# Altium project PIFWRoBot.PrjPcb
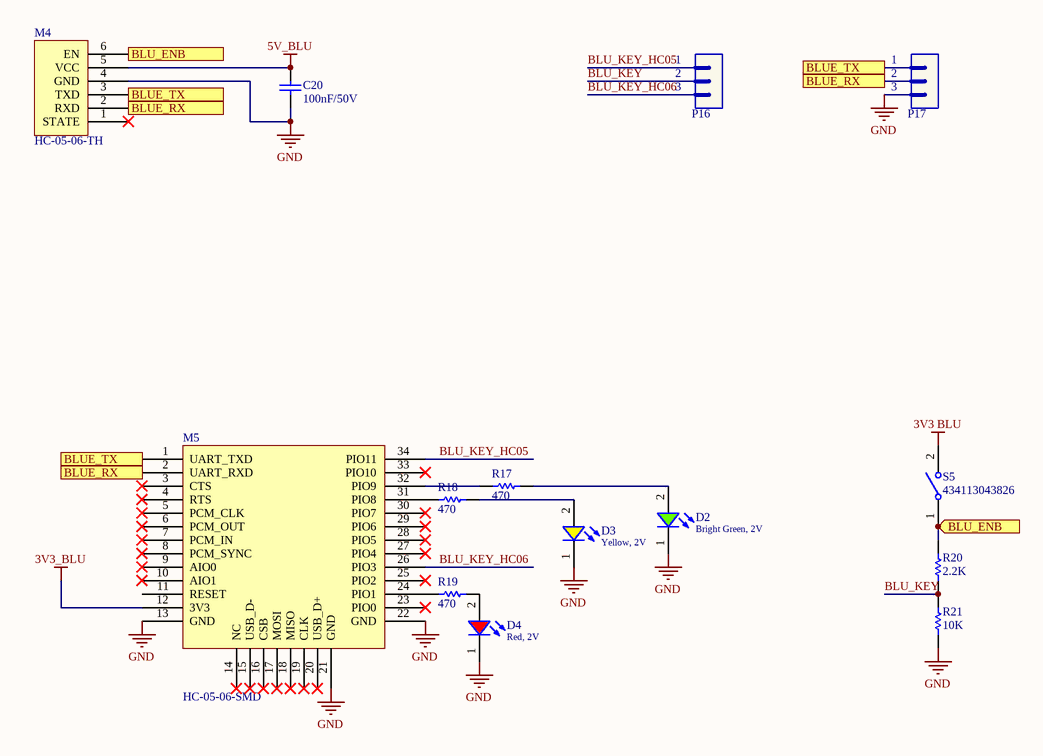
[diagram p0: Bluetooth.SchDoc]
4 sheets, 76 parts. Net scope: flat (ports and power ports of the same name join across sheets).
Board file: PIFWRoBot.PcbDoc
Sheets:
  Bluetooth.SchDoc
  Decawave.SchDoc
  RF.SchDoc
  Wifi.SchDoc

## Sheet Bluetooth.SchDoc
size A

### Parts
(Parts that share a designator on the sheet are numbered #1, #2 ... from top to bottom, then left to right.)
C20  value 100nF/50V  [CAP-SM-0805]  (hidden comment: Cap-100nF-50V-0805)
D2  Bright Green, 2V  [WL-SMCW_0805]
D3  Yellow, 2V  [WL-SMCW_0805]
D4  Red, 2V  [WL-SMCW_0805]
M4  HC-05-06-TH  [HC-05-06-TH]
M5  HC-05-06-SMD  [HC-05-06-SMD]
P16  Header 3  [JP3]  (value not drawn)
P17  Header 3  [JP3]  (value not drawn)
R17  value 470  [RES-SM-0805]  (hidden comment: Res-470-0805)
R18  value 470  [RES-SM-0805]  (hidden comment: Res-470-0805)
R19  value 470  [RES-SM-0805]  (hidden comment: Res-470-0805)
R20#1  value 2.2K  [RES-SM-0805]  (hidden comment: Res-2.2K-0805)
R21#1  value 10K  [RES-SM-0805]  (hidden comment: Res-10k-0805)
S5  434113043826  [434113043826]

### Ports
BLU_ENB (in), BLU_ENB (out), BLUE_RX (in), BLUE_RX (out), BLUE_TX (in)

### Nets
3V3 BLU: S5.2
3V3_BLU: M5.12(3V3)
5V_BLU: C20.2 M4.5(VCC)
GND: C20.1 D2.1(K) D3.1(K) D4.1(K) M4.4(GND) M5.13(GND) M5.21(GND) M5.22(GND) P17.3 R21#1.1
BLU_KEY: P16.2 R20#1.1 R21#1.2
BLU_KEY_HC05: M5.34(PIO11) P16.1
BLU_KEY_HC06: M5.26(PIO3) P16.3
NetD2_2: D2.2(A) R17.2
NetD3_2: D3.2(A) R18.2
NetD4_2: D4.2(A) R19.2
NetM4_2: M4.2(RXD) M5.2(UART_RXD) P17.2 ; port BLUE_RX
NetM4_3: M4.3(TXD) M5.1(UART_TXD) P17.1 ; port BLUE_TX
NetM4_6: M4.6(EN) R20#1.2 S5.1 ; port BLU_ENB
NetM5_24: M5.24(PIO1) R19.1
NetM5_31: M5.31(PIO8) R18.1
NetM5_32: M5.32(PIO9) R17.1

Not connected (* = marked no-connect by the designer): M4 1(STATE)*; M5 3(CTS)* 4(RTS)* 5(PCM_CLK)* 6(PCM_OUT)* 7(PCM_IN)* 8(PCM_SYNC)* 9(AIO0)* 10(AIO1)* 11(RESET) 14(NC)* 15(USB_D-)* 16(CSB)* 17(MOSI)* 18(MISO)* 19(CLK)* 20(USB_D+)* 23(PIO0)* 25(PIO2)* 27(PIO4)* 28(PIO5)* 29(PIO6)* 30(PIO7)* 33(PIO10)*

### Library data of the parts
C20 = Cap-100nF-50V-0805: CAP CER 0.1UF 50V Y5V 0805; Manufacturer: Samsung Electro-Mechanics; Manufacturer Part Number: CL21F104ZBCNNNC; Local Supplier: thegioiic; Local Supplier Link: https://thegioiic.com/products/tu-100nf-0-1uf-50v-0805; Supplier 1: Digikey; Supplier 1 Part Number: 1276-1007-1-ND; Supplier 1 Link: https://www.digikey.com/product-detail/en/samsung-electro-mechanics/CL21F104ZBCNNNC/1276-1007-1-ND/3889093
D2 = 150080VS75000: WL-SMCW SMT Mono-color Chip LED Waterclear, size 0805, Bright Green, 2V, 140deg; Chip Technology: AlInGaP; Dominant Wavelength typ.: 570nm; Luminous Intensity typ.: 40mcd; Peak Wavelength typ.: 572nm; Viewing Angle: 140deg; ComponentLink1Description: Manufacturer; ComponentLink1URL: http://www.we-online.de; ComponentLink2URL: https://www.we-online.com/catalog/datasheet/150080VS75000.pdf; ComponentLink2Description: Datasheet; Forward Voltage typ.: 2V; Emitting Color: Bright Green; Mounting Technology: SMT; Operating Temperature: -40 to +85degC; Published Date: December 2019; Part Number: 150080VS75000; Packaging: Tape and Reel; Size: 0805; Publisher: Wurth Elektronik
D3 = 150080YS75000: WL-SMCW SMT Mono-color Chip LED Waterclear, size 0805, Yellow, 2V, 140deg; Chip Technology: AlInGaP; Dominant Wavelength typ.: 590nm; Luminous Intensity typ.: 120mcd; Peak Wavelength typ.: 595nm; Viewing Angle: 140deg; ComponentLink1Description: Manufacturer; ComponentLink1URL: http://www.we-online.de; ComponentLink2URL: https://www.we-online.com/catalog/datasheet/150080YS75000.pdf; ComponentLink2Description: Datasheet; Forward Voltage typ.: 2V; Emitting Color: Yellow; Mounting Technology: SMT; Operating Temperature: -40 to +85degC; Published Date: December 2019; Part Number: 150080YS75000; Packaging: Tape and Reel; Size: 0805; Publisher: Wurth Elektronik
D4 = 150080RS75000: WL-SMCW SMT Mono-color Chip LED Waterclear, size 0805, Red, 2V, 140deg; Chip Technology: AlInGaP; Dominant Wavelength typ.: 625nm; Luminous Intensity typ.: 150mcd; Peak Wavelength typ.: 630nm; Viewing Angle: 140deg; ComponentLink1Description: Manufacturer; ComponentLink1URL: http://www.we-online.de; ComponentLink2URL: https://www.we-online.com/catalog/datasheet/150080RS75000.pdf; ComponentLink2Description: Datasheet; Forward Voltage typ.: 2V; Emitting Color: Red; Mounting Technology: SMT; Operating Temperature: -40 to +85degC; Published Date: December 2019; Part Number: 150080RS75000; Packaging: Tape and Reel; Size: 0805; Publisher: Wurth Elektronik
P16 P17 = Header 3: Header, 3-Pin; LatestRevisionDate: 17-Jul-2002; LatestRevisionNote: Re-released for DXP Platform.; Publisher: Altium Limited
R17-R19 = Res-470-0805: RES 470 OHM JUMPER 0805; Manufacturer: YAG6006CT-ND; Manufacturer Part Number: PE0805FRF7W0R047L; Local Supplier: thegioiic; Local Supplier Link: https://www.thegioiic.com/products/dien-tro-470-kohm-0805-5; Supplier 1: Digikey; Supplier 1 Link: https://www.digikey.com/product-detail/en/yageo/PE0805FRF7W0R047L/YAG6006CT-ND/9696460; Supplier 1 Part Number: YAG6006CT-ND
R20#1 = Res-2.2K-0805: RES SMD 2.2K OHM 1% 1/8W 0805; Manufacturer: TE Connectivity Passive Product; Manufacturer Part Number: CRG0805F2K2; Local Supplier: thegioiic; Local Supplier Link: https://thegioiic.com/products/dien-tro-2-2k-ohm-0805-5; Supplier 1: Digikey; Supplier 1 Link: https://www.digikey.com/product-detail/en/te-connectivity-passive-product/CRG0805F2K2/A106060CT-ND/3477706; Supplier 1 Part Number: A106060CT-ND
R21#1 = Res-10k-0805: RES 10K OHM 1% 1/4W 0805; Manufacturer: Stackpole Electronics Inc; Manufacturer Part Number: RNCP0805FTD10K0; Local Supplier: thegioiic; Local Supplier Link: https://thegioiic.com/products/dien-tro-10k-ohm-0805-5; Supplier 1: Digikey; Supplier 1 Link: https://www.digikey.com/product-detail/en/stackpole-electronics-inc/RNCP0805FTD10K0/RNCP0805FTD10K0CT-ND/2240601; Supplier 1 Part Number: RNCP0805FTD10K0CT-ND
S5 = 434113043826: WS-TASV J-Bend SMT Tact Switch 6x3.5mm, height 4.3mm, 260gf; Rated Voltage: 12VDC; Rated Current: 50mA; Washable: No; ComponentLink1Description: Manufacturer; ComponentLink1URL: http://www.we-online.de; ComponentLink2Description: Datasheet; ComponentLink2URL: https://katalog.we-online.com/em/datasheet/434113043826.pdf; Operating Temperature: -40 to +85degC; Part Number: 434113043826; Published Date: September 2019; Contact Material: Stainless Steel; Height: 4.3mm; Mounting Technology: SMT; Contact Plating: Silver; Operation Force: 260gf; Packaging: Tape and Reel; Terminal Material: Copper Alloy; Publisher: Wurth Elektronik; Terminal Plating: Silver
M4 = HC-05-06-TH: Local Supplier Link: https://hshop.vn/products/mach-thu-phat-bluetooth-hc-05-do-ra-chon-master; Local Supplier Part Number: HS000882; Manufacturer: *; Manufacturer Part Number: *; Local Supplier: HShop
M5 = HC-05-06-SMD: Local Supplier Link: https://hshop.vn/products/mach-thu-phat-bluetooth-hc-05-chua-ra-chon-master; Local Supplier Part Number: HS000881; Manufacturer: *; Manufacturer Part Number: *; Local Supplier: HShop

## Sheet Decawave.SchDoc
size A
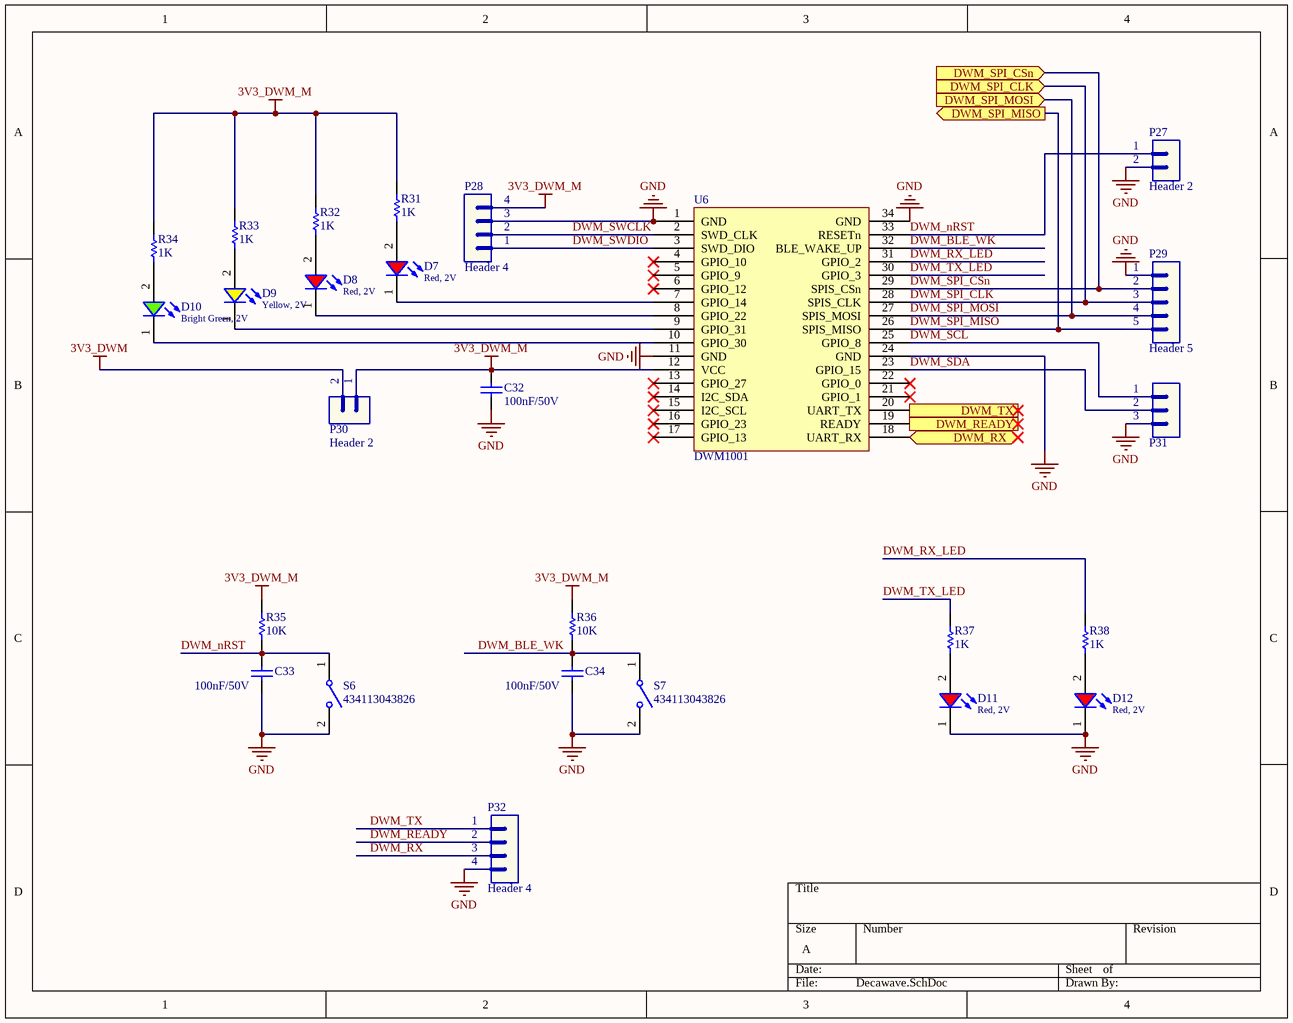
[diagram p1: Decawave.SchDoc]

### Parts
C32  value 100nF/50V  [CAP-SM-0805]  (hidden comment: Cap-100nF-50V-0805)
C33  value 100nF/50V  [CAP-SM-0805]  (hidden comment: Cap-100nF-50V-0805)
C34  value 100nF/50V  [CAP-SM-0805]  (hidden comment: Cap-100nF-50V-0805)
D7  Red, 2V  [WL-SMCW_0805]
D8  Red, 2V  [WL-SMCW_0805]
D9  Yellow, 2V  [WL-SMCW_0805]
D10  Bright Green, 2V  [WL-SMCW_0805]
D11  Red, 2V  [WL-SMCW_0805]
D12  Red, 2V  [WL-SMCW_0805]
P27  Header 2  [JP2]
P28  Header 4  [JP4]
P29  Header 5  [JP5]
P30  Header 2  [JP2]
P31  Header 3  [JP3]  (value not drawn)
P32  Header 4  [JP4]
R31  value 1K  [RES-SM-0805]  (hidden comment: Res-1K-0805)
R32  value 1K  [RES-SM-0805]  (hidden comment: Res-1K-0805)
R33  value 1K  [RES-SM-0805]  (hidden comment: Res-1K-0805)
R34  value 1K  [RES-SM-0805]  (hidden comment: Res-1K-0805)
R35  value 10K  [RES-SM-0805]  (hidden comment: Res-10k-0805)
R36  value 10K  [RES-SM-0805]  (hidden comment: Res-10k-0805)
R37  value 1K  [RES-SM-0805]  (hidden comment: Res-1K-0805)
R38  value 1K  [RES-SM-0805]  (hidden comment: Res-1K-0805)
S6  434113043826  [434113043826]
S7  434113043826  [434113043826]
U6  DWM1001  [DWM1001]

### Ports
DWM_READY, DWM_RX (bidir), DWM_SPI_CLK (in), DWM_SPI_CSn (in), DWM_SPI_MISO (out), DWM_SPI_MOSI (in), DWM_TX

### Nets
3V3_DWM: P30.2
3V3_DWM_M: C32.2 P28.4 P30.1 R31.2 R32.2 R33.2 R34.2 R35.2 R36.2 U6.12(VCC)
GND: C32.1 C33.2 C34.2 D11.1(K) D12.1(K) P27.2 P28.3 P29.1 P31.3 P32.4 S6.2 S7.2 U6.1(GND) U6.11(GND) U6.24(GND) U6.34(GND)
DWM_BLE_WK: C34.1 R36.1 S7.1 U6.32(BLE_WAKE_UP)
DWM_nRST: C33.1 P27.1 R35.1 S6.1 U6.33(RESETn)
DWM_READY: P32.2
DWM_RX: P32.3
DWM_RX_LED: R38.2 U6.31(GPIO_2)
DWM_SCL: P31.1 U6.25(GPIO_8)
DWM_SDA: P31.2 U6.23(GPIO_15)
DWM_SPI_CLK: P29.3 U6.28(SPIS_CLK) ; port DWM_SPI_CLK
DWM_SPI_CSn: P29.2 U6.29(SPIS_CSn) ; port DWM_SPI_CSn
DWM_SPI_MISO: P29.5 U6.26(SPIS_MISO) ; port DWM_SPI_MISO
DWM_SPI_MOSI: P29.4 U6.27(SPIS_MOSI) ; port DWM_SPI_MOSI
DWM_SWCLK: P28.2 U6.2(SWD_CLK)
DWM_SWDIO: P28.1 U6.3(SWD_DIO)
DWM_TX: P32.1
DWM_TX_LED: R37.2 U6.30(GPIO_3)
NetD7_1: D7.1(K) U6.7(GPIO_14)
NetD7_2: D7.2(A) R31.1
NetD8_1: D8.1(K) U6.8(GPIO_22)
NetD8_2: D8.2(A) R32.1
NetD9_1: D9.1(K) U6.9(GPIO_31)
NetD9_2: D9.2(A) R33.1
NetD10_1: D10.1(K) U6.10(GPIO_30)
NetD10_2: D10.2(A) R34.1
NetD11_2: D11.2(A) R37.1
NetD12_2: D12.2(A) R38.1
NetU6_18: U6.18(UART_RX) ; port DWM_RX
NetU6_19: U6.19(READY) ; port DWM_READY
NetU6_20: U6.20(UART_TX) ; port DWM_TX

Not connected (* = marked no-connect by the designer): U6 4(GPIO_10)* 5(GPIO_9)* 6(GPIO_12)* 13(GPIO_27)* 14(I2C_SDA)* 15(I2C_SCL)* 16(GPIO_23)* 17(GPIO_13)* 21(GPIO_1)* 22(GPIO_0)*

### Library data of the parts
C32-C34 = Cap-100nF-50V-0805: as C20 on sheet Bluetooth; Local Supplier: thegioiic; Local Supplier Link: https://thegioiic.com/products/tu-100nf-0-1uf-50v-0805; Supplier 1: Digikey; Supplier 1 Part Number: 1276-1007-1-ND; Supplier 1 Link: https://www.digikey.com/product-detail/en/samsung-electro-mechanics/CL21F104ZBCNNNC/1276-1007-1-ND/3889093
D7 D8 D11 D12 = 150080RS75000: as D4 on sheet Bluetooth; Viewing Angle: 140deg; ComponentLink1Description: Manufacturer; ComponentLink1URL: http://www.we-online.de; ComponentLink2URL: https://www.we-online.com/catalog/datasheet/150080RS75000.pdf; ComponentLink2Description: Datasheet; Forward Voltage typ.: 2V; Emitting Color: Red; Mounting Technology: SMT; Operating Temperature: -40 to +85degC; Published Date: December 2019; Part Number: 150080RS75000; Packaging: Tape and Reel; Size: 0805; Publisher: Wurth Elektronik
D9 = 150080YS75000: as D3 on sheet Bluetooth; Viewing Angle: 140deg; ComponentLink1Description: Manufacturer; ComponentLink1URL: http://www.we-online.de; ComponentLink2URL: https://www.we-online.com/catalog/datasheet/150080YS75000.pdf; ComponentLink2Description: Datasheet; Forward Voltage typ.: 2V; Emitting Color: Yellow; Mounting Technology: SMT; Operating Temperature: -40 to +85degC; Published Date: December 2019; Part Number: 150080YS75000; Packaging: Tape and Reel; Size: 0805; Publisher: Wurth Elektronik
D10 = 150080VS75000: as D2 on sheet Bluetooth; Viewing Angle: 140deg; ComponentLink1Description: Manufacturer; ComponentLink1URL: http://www.we-online.de; ComponentLink2URL: https://www.we-online.com/catalog/datasheet/150080VS75000.pdf; ComponentLink2Description: Datasheet; Forward Voltage typ.: 2V; Emitting Color: Bright Green; Mounting Technology: SMT; Operating Temperature: -40 to +85degC; Published Date: December 2019; Part Number: 150080VS75000; Packaging: Tape and Reel; Size: 0805; Publisher: Wurth Elektronik
P27 P30 = Header 2: Header, 2-Pin; LatestRevisionDate: 17-Jul-2002; LatestRevisionNote: Re-released for DXP Platform.; Publisher: Altium Limited
P28 P32 = Header 4: Header, 4-Pin; LatestRevisionDate: 17-Jul-2002; LatestRevisionNote: Re-released for DXP Platform.; Publisher: Altium Limited
P29 = Header 5: Header, 5-Pin; LatestRevisionDate: 17-Jul-2002; LatestRevisionNote: Re-released for DXP Platform.; Publisher: Altium Limited
P31 = Header 3: Header, 3-Pin; LatestRevisionDate: 17-Jul-2002; LatestRevisionNote: Re-released for DXP Platform.; Publisher: Altium Limited
R31-R34 R37 R38 = Res-1K-0805: RES 1K OHM 1% 1/4W 0805; Manufacturer: Stackpole Electronics Inc; Manufacturer Part Number: RNCP0805FTD1K00; Local Supplier: thegioiic; Local Supplier Link: https://thegioiic.com/products/dien-tro-1k-ohm-0805-5; Supplier 1: Digikey; Supplier 1 Link: https://www.digikey.com/product-detail/en/stackpole-electronics-inc/RNCP0805FTD1K00/RNCP0805FTD1K00CT-ND/2240568; Supplier 1 Part Number: RNCP0805FTD1K00CT-ND
R35 R36 = Res-10k-0805: as R21#1 on sheet Bluetooth; Local Supplier: thegioiic; Local Supplier Link: https://thegioiic.com/products/dien-tro-10k-ohm-0805-5; Supplier 1: Digikey; Supplier 1 Link: https://www.digikey.com/product-detail/en/stackpole-electronics-inc/RNCP0805FTD10K0/RNCP0805FTD10K0CT-ND/2240601; Supplier 1 Part Number: RNCP0805FTD10K0CT-ND
S6 S7 = 434113043826: as S5 on sheet Bluetooth; ComponentLink1Description: Manufacturer; ComponentLink1URL: http://www.we-online.de; ComponentLink2Description: Datasheet; ComponentLink2URL: https://katalog.we-online.com/em/datasheet/434113043826.pdf; Operating Temperature: -40 to +85degC; Part Number: 434113043826; Published Date: September 2019; Contact Material: Stainless Steel; Height: 4.3mm; Mounting Technology: SMT; Contact Plating: Silver; Operation Force: 260gf; Packaging: Tape and Reel; Terminal Material: Copper Alloy; Publisher: Wurth Elektronik; Terminal Plating: Silver

## Sheet RF.SchDoc
size A
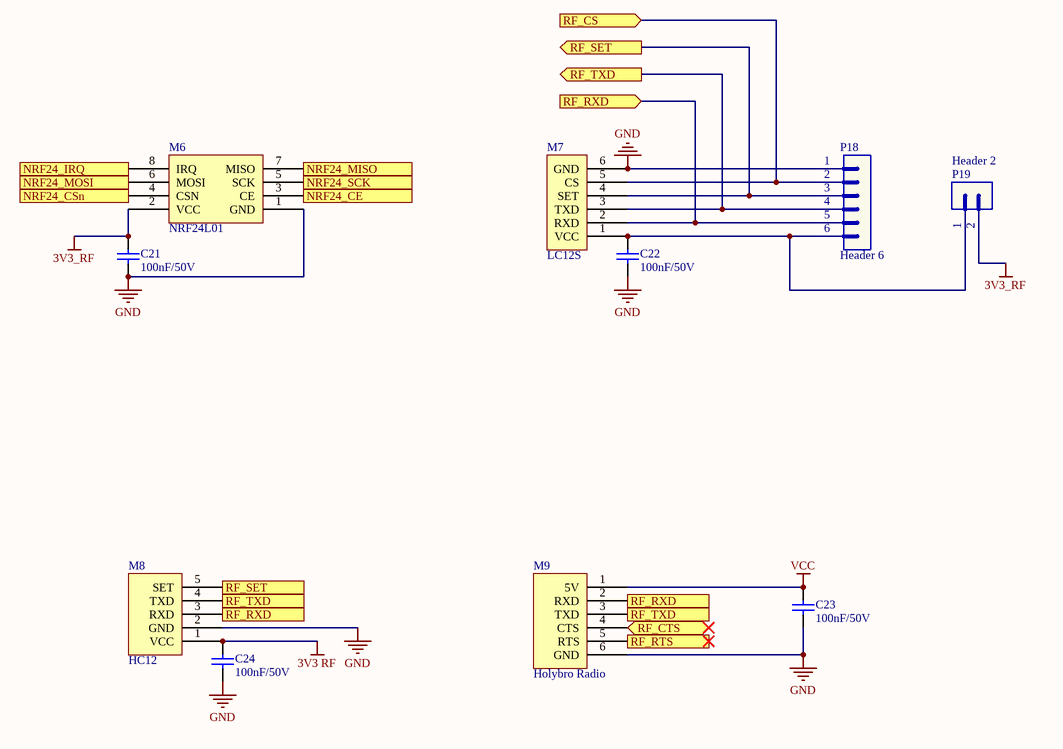
[diagram p2: RF.SchDoc]

### Parts
C21  value 100nF/50V  [CAP-SM-0805]  (hidden comment: Cap-100nF-50V-0805)
C22  value 100nF/50V  [CAP-SM-0805]  (hidden comment: Cap-100nF-50V-0805)
C23  value 100nF/50V  [CAP-SM-0805]  (hidden comment: Cap-100nF-50V-0805)
C24  value 100nF/50V  [CAP-SM-0805]  (hidden comment: Cap-100nF-50V-0805)
M6  NRF24L01  [NRF24L01]
M7  LC12S  [LC12S]
M8  HC12  [HC12]
M9  Holybro Radio  [HOLYBRO RADIO]
P18  Header 6  [JP6]
P19  Header 2  [JP2]

### Ports
NRF24_CE (in), NRF24_CSn (in), NRF24_IRQ (out), NRF24_MISO (out), NRF24_MOSI (in), NRF24_SCK (in), RF_CS (in), RF_CTS (bidir), RF_RTS, RF_RXD (in), RF_RXD (out), RF_SET (out), RF_TXD (in), RF_TXD (out)

### Nets
3V3 RF: C24.2 M8.1(VCC)
3V3_RF: C21.2 M6.2(VCC) P19.2
GND: C21.1 C22.1 C23.1 C24.1 M6.1(GND) M7.6(GND) M8.2(GND) M9.6(GND) P18.1
VCC: C23.2 M9.1(5V)
NetC22_2: C22.2 M7.1(VCC) P18.6 P19.1
NetM6_3: M6.3(CE) ; port NRF24_CE
NetM6_4: M6.4(CSN) ; port NRF24_CSn
NetM6_5: M6.5(SCK) ; port NRF24_SCK
NetM6_6: M6.6(MOSI) ; port NRF24_MOSI
NetM6_7: M6.7(MISO) ; port NRF24_MISO
NetM6_8: M6.8(IRQ) ; port NRF24_IRQ
NetM7_2: M7.2(RXD) M8.3(RXD) M9.2(RXD) P18.5 ; port RF_RXD
NetM7_3: M7.3(TXD) M8.4(TXD) M9.3(TXD) P18.4 ; port RF_TXD
NetM7_4: M7.4(SET) M8.5(SET) P18.3 ; port RF_SET
NetM7_5: M7.5(CS) P18.2 ; port RF_CS
NetM9_4: M9.4(CTS) ; port RF_CTS
NetM9_5: M9.5(RTS) ; port RF_RTS

### Library data of the parts
C21-C24 = Cap-100nF-50V-0805: as C20 on sheet Bluetooth; Local Supplier: thegioiic; Local Supplier Link: https://thegioiic.com/products/tu-100nf-0-1uf-50v-0805; Supplier 1: Digikey; Supplier 1 Part Number: 1276-1007-1-ND; Supplier 1 Link: https://www.digikey.com/product-detail/en/samsung-electro-mechanics/CL21F104ZBCNNNC/1276-1007-1-ND/3889093
P18 = Header 6: Header, 6-Pin; LatestRevisionDate: 17-Jul-2002; LatestRevisionNote: Re-released for DXP Platform.; Publisher: Altium Limited
P19 = Header 2: Header, 2-Pin; LatestRevisionDate: 17-Jul-2002; LatestRevisionNote: Re-released for DXP Platform.; Publisher: Altium Limited
M6 = NRF24L01: Local Supplier Link: https://hshop.vn/products/mach-thu-phat-nrf24l01-pa-2-4ghzcu-khech-dai-cung-suat-thu-phat; Local Supplier Part Number: HS000888; Manufacturer: *; Manufacturer Part Number: *; Local Supplier: HShop
M7 = LC12S: Local Supplier: HShop; Local Supplier Link: https://hshop.vn/products/mach-thu-phat-rf-uart-lc12s-2-4ghz; Local Supplier Part Number: HS000895; Manufacturer: *; Manufacturer Part Number: *
M8 = HC12: Local Supplier Link: https://hshop.vn/products/mach-thu-phat-rf-uart-si4463-433mhzkhoang-coch-1km; Local Supplier Part Number: HS000897; Manufacturer: *; Manufactuer Part Number: *; Local Supplier: HShop
M9 = HOLYBRO RADIO: Supploer Part Number: *; Supplier: *; Supploer Link: https://www.lazada.vn/products/ld-holybro-433mhz-915-mhz-500-mw-thu-phat-vo-tuyen-xa-bo-v3-cho-pixhawk-4-dieu-khien-chuyen-bay-i430804435-s768474304.html?spm=a2o4n.searchlist.list.4.25396b19yIS9XO&search=1; Manufacturer Part Number: *; Manufacturer: *

## Sheet Wifi.SchDoc
size A
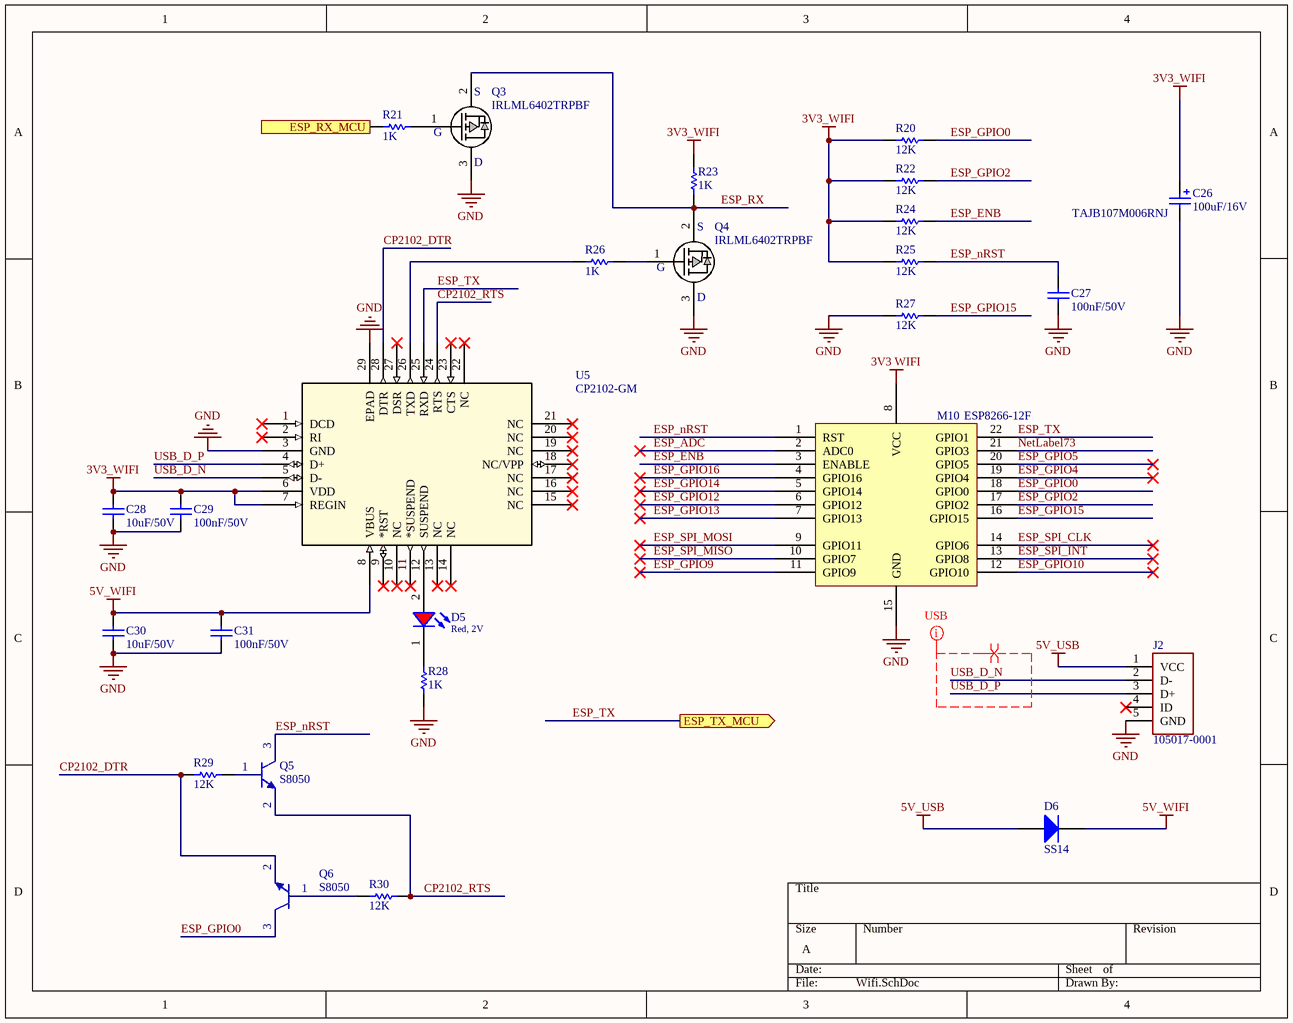
[diagram p3: Wifi.SchDoc]

### Parts
(Parts that share a designator on the sheet are numbered #1, #2 ... from top to bottom, then left to right.)
C26  value 100uF/16V  [CAP-SM-AL-SIZE-D-D6L6]  (hidden comment: Cap-Al-100uF-16V-D6L5)
C27  value 100nF/50V  [CAP-SM-0805]  (hidden comment: Cap-100nF-50V-0805)
C28  value 10uF/50V  [CAP-SM-0805]  (hidden comment: Cap-10uF-50V-0805)
C29  value 100nF/50V  [CAP-SM-0805]  (hidden comment: Cap-100nF-50V-0805)
C30  value 10uF/50V  [CAP-SM-0805]  (hidden comment: Cap-10uF-50V-0805)
C31  value 100nF/50V  [CAP-SM-0805]  (hidden comment: Cap-100nF-50V-0805)
D5  Red, 2V  [WL-SMCW_0805]
D6  SS14  [SS14]
J2  105017-0001  [CONN_105017-0001]
M10  ESP8266-12F  [ESP8266-12F]
Q3  IRLML6402TRPBF  [SOT23_NEX]
Q4  IRLML6402TRPBF  [SOT23_NEX]
Q5  S8050  [SOT23_NEX]
Q6  S8050  [SOT23_NEX]
R20#2  value 12K  [RES-SM-0805]  (hidden comment: Res-12K-0805)
R21#2  value 1K  [RES-SM-0805]  (hidden comment: Res-1K-0805)
R22  value 12K  [RES-SM-0805]  (hidden comment: Res-12K-0805)
R23  value 1K  [RES-SM-0805]  (hidden comment: Res-1K-0805)
R24  value 12K  [RES-SM-0805]  (hidden comment: Res-12K-0805)
R25  value 12K  [RES-SM-0805]  (hidden comment: Res-12K-0805)
R26  value 1K  [RES-SM-0805]  (hidden comment: Res-1K-0805)
R27  value 12K  [RES-SM-0805]  (hidden comment: Res-12K-0805)
R28  value 1K  [RES-SM-0805]  (hidden comment: Res-1K-0805)
R29  value 12K  [RES-SM-0805]  (hidden comment: Res-12K-0805)
R30  value 12K  [RES-SM-0805]  (hidden comment: Res-12K-0805)
U5  CP2102-GM  [CP2102-GM]

### Ports
ESP_RX_MCU (in), ESP_TX_MCU (out)

### Nets
3V3 WIFI: M10.8(VCC)
3V3_WIFI: C26.1 C28.1 C29.2 R20#2.1 R22.1 R23.2 R24.1 R25.1 U5.6(VDD) U5.7(REGIN)
5V_USB: D6.2(A) J2.1(VCC)
5V_WIFI: C30.2 C31.2 D6.1(K) U5.8(VBUS)
GND: C26.2 C27.1 C28.2 C29.1 C30.1 C31.1 J2.5(GND) M10.15(GND) Q3.3(D) Q4.3(D) R27.1 R28.1 U5.3(GND) U5.29(EPAD)
CP2102_DTR: Q6.2(E) R29.1 U5.28(DTR)
CP2102_RTS: Q5.2(E) R30.2 U5.24(RTS)
ESP_ADC: M10.2(ADC0)
ESP_ENB: M10.3(ENABLE) R24.2
ESP_GPIO0: M10.18(GPIO0) Q6.3(C) R20#2.2
ESP_GPIO2: M10.17(GPIO2) R22.2
ESP_GPIO4: M10.19(GPIO4)
ESP_GPIO5: M10.20(GPIO5)
ESP_GPIO9: M10.11(GPIO9)
ESP_GPIO10: M10.12(GPIO10)
ESP_GPIO12: M10.6(GPIO12)
ESP_GPIO13: M10.7(GPIO13)
ESP_GPIO14: M10.5(GPIO14)
ESP_GPIO15: M10.16(GPIO15) R27.2
ESP_GPIO16: M10.4(GPIO16)
ESP_nRST: C27.2 M10.1(RST) Q5.3(C) R25.2
ESP_RX: Q3.2(S) Q4.2(S) R23.1
ESP_SPI_CLK: M10.14(GPIO6)
ESP_SPI_INT: M10.13(GPIO8)
ESP_SPI_MISO: M10.10(GPIO7)
ESP_SPI_MOSI: M10.9(GPIO11)
ESP_TX: M10.22(GPIO1) U5.25(RXD) ; port ESP_TX_MCU
NetLabel73: M10.21(GPIO3)
USB_D_N: J2.2(D-) U5.5(D-)
USB_D_P: J2.3(D+) U5.4(D+)
NetD5_1: D5.1(K) R28.2
NetD5_2: D5.2(A) U5.12(SUSPEND)
NetQ3_1: Q3.1(G) R21#2.2
NetQ4_1: Q4.1(G) R26.1
NetQ5_1: Q5.1(B) R29.2
NetQ6_1: Q6.1(B) R30.1
NetR21#2_1: R21#2.1 ; port ESP_RX_MCU
NetR26_2: R26.2 U5.26(TXD)

Not connected (* = marked no-connect by the designer): J2 4(ID)*; U5 1(DCD)* 2(RI)* 9(*RST)* 10(NC)* 11(*SUSPEND)* 13(NC)* 14(NC)* 15(NC)* 16(NC)* 17(NC)* 18(NC/VPP)* 19(NC)* 20(NC)* 21(NC)* 22(NC)* 23(CTS)* 27(DSR)*

### Layout directives
differential pair: USB_D_N, USB_D_P
mark named USB: USB_D_N, USB_D_P

### Notes on the sheet
- (near C26) TAJB107M006RNJ

### Library data of the parts
C26 = Cap-Al-100uF-16V-D6L5: CAP ALUM 100UF 20% 16V SMD; Manufacturer: Nichicon; Manufacturer Part Number: UWX1C101MCL1GB; Local Supplier: thegioiic; Local Supplier Link: https://thegioiic.com/products/tu-nhom-smd-100uf-16v-d6-3l5-4; Supplier 1: Digikey; Supplier 1 Part Number: 493-2105-1-ND; Supplier 1 Link: https://www.digikey.com/product-detail/en/nichicon/UWX1C101MCL1GB/493-2105-1-ND/590080
C27 C29 C31 = Cap-100nF-50V-0805: as C20 on sheet Bluetooth; Local Supplier: thegioiic; Local Supplier Link: https://thegioiic.com/products/tu-100nf-0-1uf-50v-0805; Supplier 1: Digikey; Supplier 1 Part Number: 1276-1007-1-ND; Supplier 1 Link: https://www.digikey.com/product-detail/en/samsung-electro-mechanics/CL21F104ZBCNNNC/1276-1007-1-ND/3889093
C28 C30 = Cap-10uF-50V-0805: CAP CER 10UF 50V X5R 0805; Manufacturer: Yageo; Manufacturer Part Number: CC0805KKX5R9BB106; Local Supplier: thegioiic; Local Supplier Link: https://thegioiic.com/products/tu-10uf-50v-0805; Supplier 1: Digikey; Supplier 1 Link: https://www.digikey.com/product-detail/en/yageo/CC0805KKX5R9BB106/311-3499-2-ND/7164383; Supplier 1 Part Number: 311-3499-2-ND
D5 = 150080RS75000: as D4 on sheet Bluetooth; Viewing Angle: 140deg; ComponentLink1Description: Manufacturer; ComponentLink1URL: http://www.we-online.de; ComponentLink2URL: https://www.we-online.com/catalog/datasheet/150080RS75000.pdf; ComponentLink2Description: Datasheet; Forward Voltage typ.: 2V; Emitting Color: Red; Mounting Technology: SMT; Operating Temperature: -40 to +85degC; Published Date: December 2019; Part Number: 150080RS75000; Packaging: Tape and Reel; Size: 0805; Publisher: Wurth Elektronik
D6 = Diode-SS14: DIODE SCHOTTKY 40V 1A SMA; Manufacturer: ON Semiconductor; Local Supplier: thegioiic; Local Supplier Link: https://thegioiic.com/products/ss14-sma; Supplier 1: Digikey; Supplier 1 Link: https://www.digikey.com/product-detail/en/on-semiconductor/SS14/SS14CT-ND/965729; Manufacturer Part Number: SS14; Supplier 1 Part Number: SS14CT-ND
J2 = 105017-0001: No Description Available; Vendor: Molex Connector Corporation; Built_By: EMA_Cory; SourceLibrary: Molex_2020-05-26; Datasheet: https://www.molex.com/pdm_docs/sd/1050170001_sd.pdf; Manufacturer_Part_Number: 105017-0001; Copyright: Copyright (C) 2018 Accelerated Designs. All rights reserved; RefDes: RefDes; Type: DEV
Q3 Q4 = IRLML6402TRPBF: P-Channel 20V 3.7A (Ta) 1.3W (Ta) Surface Mount Micro3™/SOT-23
R20#2 R22 R24 R25 R27 R29 R30 = Res-12K-0805: RES 12 KOHM JUMPER 0805; Manufacturer: Vishay Thin Film; Manufacturer Part Number: PAT0805E3121BST1; Local Supplier: icdayroi; Local Supplier Link: https://icdayroi.com/dien-tro-12k-0805-1-goi-50-con; Supplier 1: Digikey; Supplier 1 Link: https://www.digikey.com/product-detail/en/vishay-thin-film/PAT0805E3121BST1/PAT0805E3121BST1-ND/2281536; Supplier 1 Part Number: PAT0805E3121BST1-ND
R21#2 R23 R26 R28 = Res-1K-0805: as R31 on sheet Decawave; Local Supplier: thegioiic; Local Supplier Link: https://thegioiic.com/products/dien-tro-1k-ohm-0805-5; Supplier 1: Digikey; Supplier 1 Link: https://www.digikey.com/product-detail/en/stackpole-electronics-inc/RNCP0805FTD1K00/RNCP0805FTD1K00CT-ND/2240568; Supplier 1 Part Number: RNCP0805FTD1K00CT-ND
U5 = CP2102-GM: Vendor: Silicon Labs; Built_By: EMA_UL_Team; SourceLibrary: Silicon_Labs_2015-03-23; Manufacturer_Part_Number: CP2102-GM; Copyright: Copyright (C) 2018 Accelerated Designs. All rights reserved; RefDes: RefDes; Type: DEV
M10 = ESP8266-12F: Local Supplier: HShop; Local Supplier Link: https://hshop.vn/products/mach-thu-phat-wifi-soc-esp8266-v12; Local Supplier Link Part Number: HS000912; Manufacturer: *; Manufacturer Part Number: *

## Nets that join several sheets
GND: Bluetooth (10 pins), Decawave (16 pins), RF (9 pins), Wifi (14 pins)